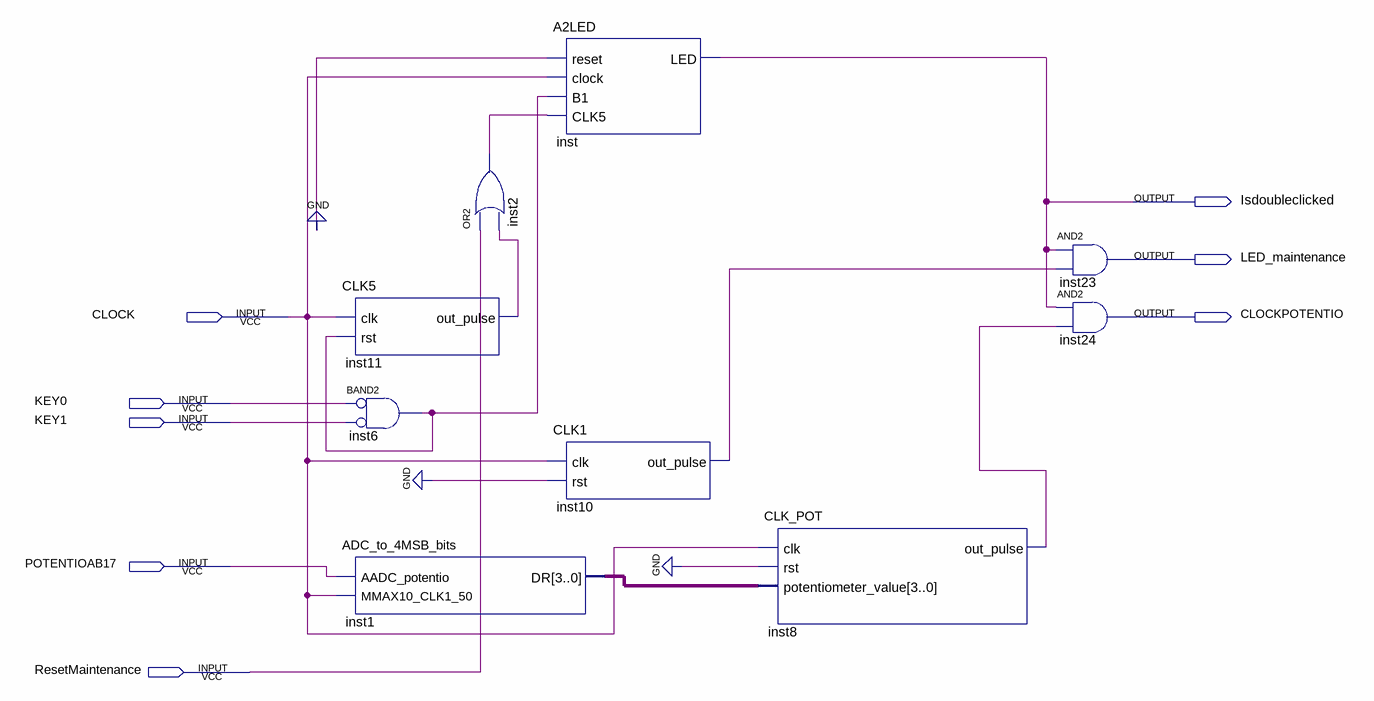
[diagram p0: schematic sheet]
// Quartus schematic FS1.bdf as structural Verilog: 9 symbols, 8 pins
module FS1 (
  input  CLOCK,
  input  KEY0,
  input  KEY1,
  input  POTENTIOAB17,
  input  ResetMaintenance,
  output Isdoubleclicked,
  output LED_maintenance,
  output CLOCKPOTENTIO
);

  wire inst2_out, inst6_out, inst8_out_pulse, inst10_out_pulse, inst11_out_pulse;
  wire [3:0] inst1_dr;

  CLK5 inst11 (.clk(CLOCK), .rst(inst6_out), .out_pulse(inst11_out_pulse));
  and inst6 (inst6_out, ~KEY0, ~KEY1);  // BAND2
  ADC_to_4MSB_bits inst1 (.AADC_potentio(POTENTIOAB17), .MMAX10_CLK1_50(CLOCK), .DR(inst1_dr));
  or inst2 (inst2_out, ResetMaintenance, inst11_out_pulse);
  A2LED inst (.reset(1'b0), .clock(CLOCK), .B1(inst6_out), .CLK5(inst2_out), .LED(Isdoubleclicked));
  CLK1 inst10 (.clk(CLOCK), .rst(1'b0), .out_pulse(inst10_out_pulse));
  CLK_POT inst8 (.clk(CLOCK), .rst(1'b0), .potentiometer_value(inst1_dr), .out_pulse(inst8_out_pulse));
  and inst23 (LED_maintenance, Isdoubleclicked, inst10_out_pulse);
  and inst24 (CLOCKPOTENTIO, Isdoubleclicked, inst8_out_pulse);
endmodule
